# Altium schematic sheet k26_baseboard_usb.SchDoc: k26 Baseboard USB0 PHY and HUB
size A3; DrawnBy: Ch. Vogt; Organization: PBL; DocumentNumber: 1; Revision: r5; SheetNumber: 10
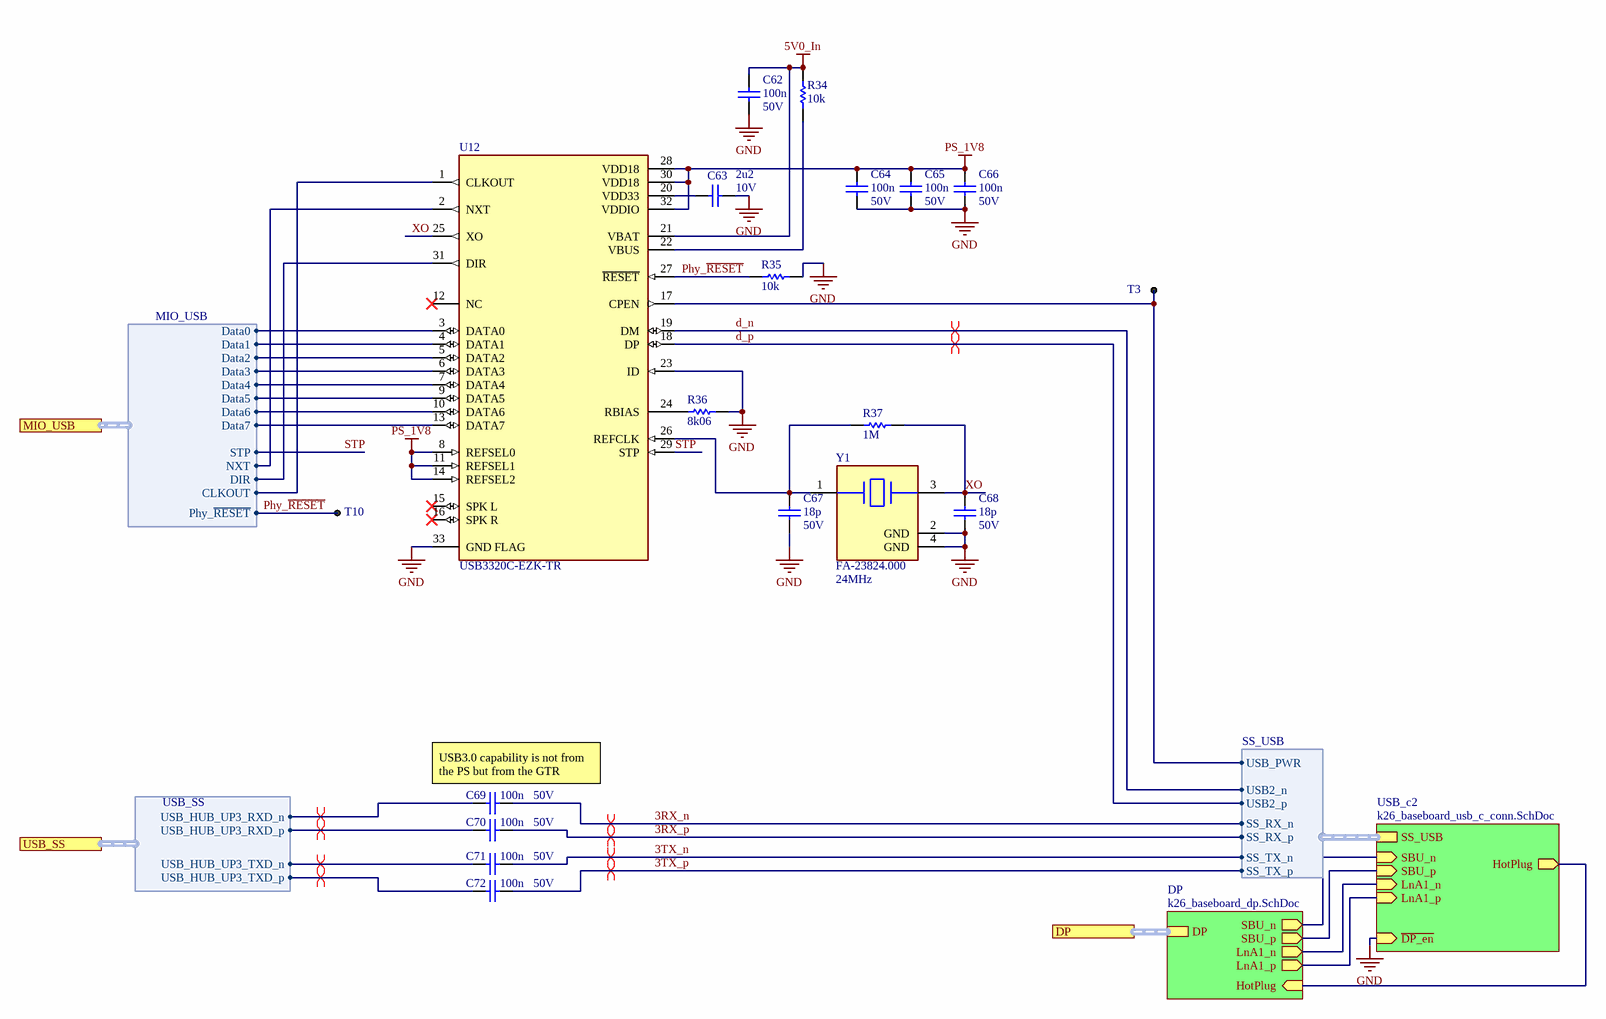
[diagram p0: k26_baseboard_usb.SchDoc]

## Parts
C62  100n  Rated DC Voltage (URdc): 50V  [CAPC0402]
C63  2u2  Rated DC Voltage (URdc): 10V  [CAPC0402]
C64  100n  Rated DC Voltage (URdc): 50V  [CAPC0402]
C65  100n  Rated DC Voltage (URdc): 50V  [CAPC0402]
C66  100n  Rated DC Voltage (URdc): 50V  [CAPC0402]
C67  18p  Rated DC Voltage (URdc): 50V  [CAPC0402]
C68  18p  Rated DC Voltage (URdc): 50V  [CAPC0402]
C69  100n  Rated DC Voltage (URdc): 50V  [CAPC0402]
C70  100n  Rated DC Voltage (URdc): 50V  [CAPC0402]
C71  100n  Rated DC Voltage (URdc): 50V  [CAPC0402]
C72  100n  Rated DC Voltage (URdc): 50V  [CAPC0402]
R34  10k  [RES0402]
R35  10k  [RES0402]
R36  8k06  [RES0402]
R37  1M  [RES0402]
T3  (no value)  [Pad-1mm]  (no BOM)
T10  (no value)  [Pad-1mm]  (no BOM)
U12  USB3320C-EZK-TR  [FP-32QFN-3304-5X5B-IPC_C]
Y1  FA-23824.000  Frequency: 24MHz  [FP-FA-238_27_0000MB-C3-MFG]

## Sub-sheets
DP = k26_baseboard_dp.SchDoc: DP (harness DP), SBU_n (out), SBU_p (out), HotPlug (in), LnA1_p (out), LnA1_n (out)
USB_c2 = k26_baseboard_usb_c_conn.SchDoc: ~{DP_en} (in), SS_USB (harness SS_USB), SBU_n (in), SBU_p (in), HotPlug (out), LnA1_p (in), LnA1_n (in)

## Ports
DP (harness DP), MIO_USB (harness MIO_USB), USB_SS (harness USB_SS)

## Harnesses
MIO_USB: Data0, Data1, Data2, Data3, Data4, Data5, Data6, Data7, STP, NXT, DIR, CLKOUT, Phy_~{RESET}
USB_SS: USB_HUB_UP3_RXD_n, USB_HUB_UP3_RXD_p, USB_HUB_UP3_TXD_n, USB_HUB_UP3_TXD_p
SS_USB: SS_RX_p, SS_RX_n, SS_TX_p, SS_TX_n, USB2_n, USB2_p, USB_PWR

## Nets
5V0_In: C62.2 R34.2 U12.21(VBAT)
GND: C62.1 C63.1 C64.1 C65.1 C66.1 C67.1 C68.1 R35.2 R36.1 U12.23(ID) U12.33(GND_FLAG) Y1.2(GND) Y1.4(GND) ; sheet USB_c2/~{DP_en}
PS_1V8: C64.2 C65.2 C66.2 U12.8(REFSEL0) U12.11(REFSEL1) U12.14(REFSEL2) U12.28(VDD18) U12.30(VDD18) U12.32(VDDIO)
3RX_n: C69.1 ; sheet USB_c2/SS_USB.SS_RX_n
3RX_p: C70.1 ; sheet USB_c2/SS_USB.SS_RX_p
3TX_n: C71.1 ; sheet USB_c2/SS_USB.SS_TX_n
3TX_p: C72.1 ; sheet USB_c2/SS_USB.SS_TX_p
d_n: U12.19(DM) ; sheet USB_c2/SS_USB.USB2_n
d_p: U12.18(DP) ; sheet USB_c2/SS_USB.USB2_p
Phy_~{RESET}: R35.1 T10.1 U12.27(~{RESET}) ; port MIO_USB.Phy_~{RESET}
STP: U12.29(STP) ; port MIO_USB.STP
XO: C68.2 R37.2 U12.25(XO) Y1.3
NetC63_2: C63.2 U12.20(VDD33)
NetC67_2: C67.2 R37.1 U12.26(REFCLK) Y1.1
NetC69_2: C69.2 ; port USB_SS.USB_HUB_UP3_RXD_n
NetC70_2: C70.2 ; port USB_SS.USB_HUB_UP3_RXD_p
NetC71_2: C71.2 ; port USB_SS.USB_HUB_UP3_TXD_n
NetC72_2: C72.2 ; port USB_SS.USB_HUB_UP3_TXD_p
NetR34_1: R34.1 U12.22(VBUS)
NetR36_2: R36.2 U12.24(RBIAS)
NetT3_1: T3.1 U12.17(CPEN) ; sheet USB_c2/SS_USB.USB_PWR
NetU12_1: U12.1(CLKOUT) ; port MIO_USB.CLKOUT
NetU12_2: U12.2(NXT) ; port MIO_USB.NXT
NetU12_3: U12.3(DATA0) ; port MIO_USB.Data0
NetU12_4: U12.4(DATA1) ; port MIO_USB.Data1
NetU12_5: U12.5(DATA2) ; port MIO_USB.Data2
NetU12_6: U12.6(DATA3) ; port MIO_USB.Data3
NetU12_7: U12.7(DATA4) ; port MIO_USB.Data4
NetU12_9: U12.9(DATA5) ; port MIO_USB.Data5
NetU12_10: U12.10(DATA6) ; port MIO_USB.Data6
NetU12_13: U12.13(DATA7) ; port MIO_USB.Data7
NetU12_31: U12.31(DIR) ; port MIO_USB.DIR
(unnamed): sheet USB_c2/SBU_n, sheet DP/SBU_n
(unnamed): sheet USB_c2/SBU_p, sheet DP/SBU_p
(unnamed): sheet USB_c2/HotPlug, sheet DP/HotPlug
(unnamed): sheet USB_c2/LnA1_p, sheet DP/LnA1_p
(unnamed): sheet USB_c2/LnA1_n, sheet DP/LnA1_n

Not connected (* = marked no-connect by the designer): U12 12(NC)* 15(SPK_L)* 16(SPK_R)*

## Buses and harness runs
harness port DP = sheet DP/DP

## Layout directives
differential pair: 3RX_n, 3RX_p, 3TX_n, 3TX_p, d_n, d_p, NetC69_2, NetC70_2, NetC71_2, NetC72_2

## Notes on the sheet
- (near C69) USB3.0 capability is not from the PS but from the GTR
- 1
- 2
- 3
- 4
- 5
- 6
- 7
- 8
- A
- B
- C
- D
- Project:
- Date:
- Drawing number:
- Rev:
- Format:
- A3
- Drawn by:
- Laboratory:
- Page
- Sheet:
- of
- File:

## Library data of the parts
C62 C64-C66 C69-C72 = cap0402: Ceramic Capacitor, Multilayer, Ceramic, 50V, 10% +Tol, 10% -Tol, X5R, 15% TC, 0.1uF, Surface Mount, 0402; Manufacturer: Yageo; Manufacturer Part Number: CC0402KRX5R9BB104; Capacitance: 100nF; Multilayer: Yes; Supplier 1: Farnell; Supplier Part Number 1: 3366442; RoHS: Yes; Category: Ceramic Capacitors; Stock 1: 180000; Pricing 1: 10000=0.00890, 50000=0.00870 (CHF); Mount: Surface Mount; Number of Pins: 2; Dielectric Material: Ceramic; Package Shape: Rectangular; Size Code: 0402; Terminal Finish: Nickel; Min Operating Temperature: -55°C; Max Operating Temperature: 85°C; JESD-609 Code: e3; Capacitor Type: Ceramic; Negative Tolerance: 10%; Temperature Characteristics Code: X5R; Termination: Wraparound; Positive Tolerance: 10%; Package Style: SMTMeter; Packaging: Tape and Reel; Length: 1mm; Width: 0.5mm; Height: 0.5mm; Reach SVHC Compliant: Yes; RoHS Compliant: Yes; ComponentLink1URL: https://datasheet.ciiva.com:443/pdfs/VipMasterIC/IC/YAGO/YAGO-S-A0006851646/YAGO-S-A0006851646-1.pdf?src-supplier=IHS+Markit; ComponentLink1Description: https://datasheet.ciiva.com:443/pdfs/VipMasterIC/IC/YAGO/YAGO-S-A0006851646/YAGO-S-A0006851646-1.pdf?src-supplier=IHS+Markit; ComponentLink2URL: http://www.yageo.com/documents/recent/UPY-GPHC_X5R_4V-to-50V_25.pdf?src-supplier=Digi-Key; ComponentLink2Description: http://www.yageo.com/documents/recent/UPY-GPHC_X5R_4V-to-50V_25.pdf?src-supplier=Digi-Key; ComponentLink3URL: http://www.yageo.com/documents/recent/UPY-GPHC_X5R_4V-to-50V_23.pdf?src-supplier=Digi-Key; ComponentLink3Description: http://www.yageo.com/documents/recent/UPY-GPHC_X5R_4V-to-50V_23.pdf?src-supplier=Digi-Key
C63 = cap0402: Ceramic Capacitor, Multilayer, Ceramic, 10V, 10% +Tol, 10% -Tol, X7S, 22% TC, 2.2uF, Surface Mount, 0402; Manufacturer: TDK; Manufacturer Part Number: C1005X7S1A225K050BC; Multilayer: Yes; Supplier: Rs; Supplier Part Number: 9156436P; RoHS: Yes; Category: Ceramic Capacitors; Stock: 5000; Pricing: 150=0.11900, 500=0.10700, 2500=0.08300 (CHF); Mounting Technology: Surface Mount; Pins: 2; Dielectric Material: Ceramic; Case/Package: 0402; Package Shape: Rectangular; Terminal Finish: Nickel; Min Operating Temperature: -55°C; Max Operating Temperature: 125°C; Value: 2.2uF; Capacitor Type: Ceramic; Tolerance  (fill in as +-): 10%; Packaging: Tape and Reel; Tolerance (fill in as +-): 10%; Temperature Characteristics Code: X7S; JESD-609 Code: e3; Termination: Wraparound; Package Style: SMTMeter; Length: 1mm; Width: 0.5mm; Height: 0.5mm; Reach SVHC Compliant: Yes; RoHS Compliant: Yes; ComponentLink1URL: https://datasheet.ciiva.com:443/pdfs/VipMasterIC/IC/TDKC/TDKC-S-A0008796792/TDKC-S-A0008796792-1.pdf?src-supplier=IHS+Markit; ComponentLink1Description: https://datasheet.ciiva.com:443/pdfs/VipMasterIC/IC/TDKC/TDKC-S-A0008796792/TDKC-S-A0008796792-1.pdf?src-supplier=IHS+Markit; ComponentLink2URL: https://datasheet.ciiva.com/24218/c1005x7s1a225k050bc-264486-24218484.pdf?src-supplier=Mouser; ComponentLink2Description: https://datasheet.ciiva.com/24218/c1005x7s1a225k050bc-264486-24218484.pdf?src-supplier=Mouser; ComponentLink3URL: https://datasheet.ciiva.com/6274/tdkmlcccaprange-6274910.pdf?src-supplier=Digi-Key; ComponentLink3Description: https://datasheet.ciiva.com/6274/tdkmlcccaprange-6274910.pdf?src-supplier=Digi-Key
C67 C68 = cap0402: Ceramic Capacitor, Multilayer, Ceramic, 50V, 5% +Tol, 5% -Tol, C0G, -/+30ppm/Cel TC, 0.000018uF, Surface Mount, 0402; Manufacturer: Murata; Manufacturer Part Number: GRM1555C1H180JA01D; Value: 18pF; Multilayer: Yes; Supplier: Mouser; Supplier Part Number: 81-GRM1555C1H180JA1D; RoHS: Yes; Category: Ceramic Capacitors; Stock: 265782; Pricing: 1=0.10000, 10=0.01500, 50=0.01500, 100=0.00800, 1000=0.00500, 10000=0.00400 (USD); Mounting Technology: Surface Mount; Pins: 2; Dielectric Material: Ceramic; Case/Package: 0402; Terminal Finish: Nickel; Package Shape: Rectangular; Min Operating Temperature: -55°C; Max Operating Temperature: 125°C; JESD-609 Code: e3; Capacitor Type: Ceramic; Tolerance  (fill in as +-): 5%; Packaging: Tape and Reel; Tolerance (fill in as +-): 5%; Temperature Characteristics Code: C0G; Termination: Wraparound; Package Style: SMTMeter; Length: 1mm; Width: 0.5mm; Height: 0.5mm; RoHS Compliant: Yes; Reach SVHC Compliant: Yes
  C67: ComponentLink1URL: https://datasheet.ciiva.com:443/pdfs/VipMasterIC/IC/MURE/MURE-S-A0008911298/MURE-S-A0008911417-1.pdf?src-supplier=IHS+Markit; ComponentLink1Description: https://datasheet.ciiva.com:443/pdfs/VipMasterIC/IC/MURE/MURE-S-A0008911298/MURE-S-A0008911417-1.pdf?src-supplier=IHS+Markit; ComponentLink2URL: https://datasheet.ciiva.com/6068/1747440-6068179.pdf?src-supplier=Farnell; ComponentLink2Description: https://datasheet.ciiva.com/6068/1747440-6068179.pdf?src-supplier=Farnell; ComponentLink3URL: https://datasheet.ciiva.com/18184/getdatasheetpartid-316062-18184207.pdf?src-supplier=Verical; ComponentLink3Description: https://datasheet.ciiva.com/18184/getdatasheetpartid-316062-18184207.pdf?src-supplier=Verical; ComponentLink4URL: https://datasheet.ciiva.com/11786/0900766b80ef921d-11786269.pdf?src-supplier=Rs; ComponentLink4Description: https://datasheet.ciiva.com/11786/0900766b80ef921d-11786269.pdf?src-supplier=Rs; ComponentLink5URL: https://datasheet.ciiva.com/29200/453634-da-01-en-vs-kondensator-0402-29200152.pdf?src-supplier=Conrad; ComponentLink5Description: https://datasheet.ciiva.com/29200/453634-da-01-en-vs-kondensator-0402-29200152.pdf?src-supplier=Conrad; ComponentLink6URL: https://datasheet.ciiva.com/22698/1747440-22698394.pdf?src-supplier=Element14; ComponentLink6Description: https://datasheet.ciiva.com/22698/1747440-22698394.pdf?src-supplier=Element14; ComponentLink7URL: https://datasheet.ciiva.com/163/partnumbering-e-01-163478.pdf?src-supplier=Digi-Key; ComponentLink7Description: https://datasheet.ciiva.com/163/partnumbering-e-01-163478.pdf?src-supplier=Digi-Key; ComponentLink8URL: https://datasheet.ciiva.com/163/partnumbering-e-01-163477.pdf?src-supplier=Digi-Key; ComponentLink8Description: https://datasheet.ciiva.com/163/partnumbering-e-01-163477.pdf?src-supplier=Digi-Key; ComponentLink9URL: https://datasheet.ciiva.com/163/partnumbering-e-01-163479.pdf?src-supplier=Digi-Key; ComponentLink9Description: https://datasheet.ciiva.com/163/partnumbering-e-01-163479.pdf?src-supplier=Digi-Key; ComponentLink10URL: https://datasheet.ciiva.com/5419/product-5419130.pdf?src-supplier=Mouser; ComponentLink10Description: https://datasheet.ciiva.com/5419/product-5419130.pdf?src-supplier=Mouser
  C68: ComponentLink1URL: https://datasheet.ciiva.com:443/pdfs/VipMasterIC/IC/YAGO/YAGO-S-A0006851646/YAGO-S-A0006851646-1.pdf?src-supplier=IHS+Markit; ComponentLink1Description: https://datasheet.ciiva.com:443/pdfs/VipMasterIC/IC/YAGO/YAGO-S-A0006851646/YAGO-S-A0006851646-1.pdf?src-supplier=IHS+Markit; ComponentLink2URL: http://www.yageo.com/documents/recent/UPY-GPHC_X5R_4V-to-50V_25.pdf?src-supplier=Digi-Key; ComponentLink2Description: http://www.yageo.com/documents/recent/UPY-GPHC_X5R_4V-to-50V_25.pdf?src-supplier=Digi-Key; ComponentLink3URL: http://www.yageo.com/documents/recent/UPY-GPHC_X5R_4V-to-50V_23.pdf?src-supplier=Digi-Key; ComponentLink3Description: http://www.yageo.com/documents/recent/UPY-GPHC_X5R_4V-to-50V_23.pdf?src-supplier=Digi-Key; ComponentLink4URL: https://datasheet.ciiva.com:443/pdfs/VipMasterIC/IC/MURE/MURE-S-A0008911298/MURE-S-A0008911417-1.pdf?src-supplier=IHS+Markit; ComponentLink4Description: https://datasheet.ciiva.com:443/pdfs/VipMasterIC/IC/MURE/MURE-S-A0008911298/MURE-S-A0008911417-1.pdf?src-supplier=IHS+Markit; ComponentLink5URL: https://datasheet.ciiva.com/6068/1747440-6068179.pdf?src-supplier=Farnell; ComponentLink5Description: https://datasheet.ciiva.com/6068/1747440-6068179.pdf?src-supplier=Farnell; ComponentLink6URL: https://datasheet.ciiva.com/18184/getdatasheetpartid-316062-18184207.pdf?src-supplier=Verical; ComponentLink6Description: https://datasheet.ciiva.com/18184/getdatasheetpartid-316062-18184207.pdf?src-supplier=Verical; ComponentLink7URL: https://datasheet.ciiva.com/11786/0900766b80ef921d-11786269.pdf?src-supplier=Rs; ComponentLink7Description: https://datasheet.ciiva.com/11786/0900766b80ef921d-11786269.pdf?src-supplier=Rs; ComponentLink8URL: https://datasheet.ciiva.com/29200/453634-da-01-en-vs-kondensator-0402-29200152.pdf?src-supplier=Conrad; ComponentLink8Description: https://datasheet.ciiva.com/29200/453634-da-01-en-vs-kondensator-0402-29200152.pdf?src-supplier=Conrad; ComponentLink9URL: https://datasheet.ciiva.com/22698/1747440-22698394.pdf?src-supplier=Element14; ComponentLink9Description: https://datasheet.ciiva.com/22698/1747440-22698394.pdf?src-supplier=Element14; ComponentLink10URL: https://datasheet.ciiva.com/163/partnumbering-e-01-163478.pdf?src-supplier=Digi-Key; ComponentLink10Description: https://datasheet.ciiva.com/163/partnumbering-e-01-163478.pdf?src-supplier=Digi-Key; ComponentLink11URL: https://datasheet.ciiva.com/163/partnumbering-e-01-163477.pdf?src-supplier=Digi-Key; ComponentLink11Description: https://datasheet.ciiva.com/163/partnumbering-e-01-163477.pdf?src-supplier=Digi-Key; ComponentLink12URL: https://datasheet.ciiva.com/163/partnumbering-e-01-163479.pdf?src-supplier=Digi-Key; ComponentLink12Description: https://datasheet.ciiva.com/163/partnumbering-e-01-163479.pdf?src-supplier=Digi-Key; ComponentLink13URL: https://datasheet.ciiva.com/5419/product-5419130.pdf?src-supplier=Mouser; ComponentLink13Description: https://datasheet.ciiva.com/5419/product-5419130.pdf?src-supplier=Mouser
R34 R35 = res0402: Fixed Resistor, Metal Glaze/thick Film, 0.1W, 10000ohm, 50V, 1% +/-Tol, 100ppm/Cel, Surface Mount, 0402; Manufacturer: Panasonic; Manufacturer Part Number: ERJ-2RKF1002X; Power: 100mW; Value: 10kR; Temperature Coefficient: 100ppm/°C; Rated Temperature: 70°C; Package Height: 0.35mm; Package Length: 1mm; Package Width: 0.5mm; Reference Standard: AEC-Q200; ComponentLink1URL: https://datasheet.ciiva.com:443/pdfs/VipMasterIC/IC/PANA/PANA-S-A0009889626/PANA-S-A0009889626-1.pdf?src-supplier=IHS+Markit; ComponentLink1Description: https://datasheet.ciiva.com:443/pdfs/VipMasterIC/IC/PANA/PANA-S-A0009889626/PANA-S-A0009889626-1.pdf?src-supplier=IHS+Markit; ComponentLink2URL: https://datasheet.ciiva.com/6201/426256-6201373.pdf?src-supplier=Farnell; ComponentLink2Description: https://datasheet.ciiva.com/6201/426256-6201373.pdf?src-supplier=Farnell; ComponentLink3URL: https://datasheet.ciiva.com/46377/426256-46377550.pdf?src-supplier=Element14; ComponentLink3Description: https://datasheet.ciiva.com/46377/426256-46377550.pdf?src-supplier=Element14; ComponentLink4URL: https://datasheet.ciiva.com/22749/1678782-22749610.pdf?src-supplier=Element14; ComponentLink4Description: https://datasheet.ciiva.com/22749/1678782-22749610.pdf?src-supplier=Element14; ComponentLink5URL: https://datasheet.ciiva.com/28695/1678782-28695781.pdf?src-supplier=Element14; ComponentLink5Description: https://datasheet.ciiva.com/28695/1678782-28695781.pdf?src-supplier=Element14; ComponentLink6URL: https://datasheet.ciiva.com/16766/70260748-16766015.pdf?src-supplier=Allied+Electronics; ComponentLink6Description: https://datasheet.ciiva.com/16766/70260748-16766015.pdf?src-supplier=Allied+Electronics; ComponentLink7URL: https://datasheet.ciiva.com/16765/70260748-16765054.pdf?src-supplier=Allied+Electronics; ComponentLink7Description: https://datasheet.ciiva.com/16765/70260748-16765054.pdf?src-supplier=Allied+Electronics; ComponentLink8URL: https://datasheet.ciiva.com/9181/aoa0000ce2-9181461.pdf?src-supplier=Avnet; ComponentLink8Description: https://datasheet.ciiva.com/9181/aoa0000ce2-9181461.pdf?src-supplier=Avnet; ComponentLink9URL: https://datasheet.ciiva.com/16508/aoa0000ce2-16508382.pdf?src-supplier=Future+Electronics; ComponentLink9Description: https://datasheet.ciiva.com/16508/aoa0000ce2-16508382.pdf?src-supplier=Future+Electronics; Supplier: Rs; Supplier Part Number: 7325246; RoHS: Yes; Category: Chip SMD Resistors; Stock: 1630000; Pricing: 10000=0.00600, 30000=0.00500 (CHF); Mounting Technology: Surface Mount; Pins: 2; Case/Package: 0402; Terminal Finish: Nickel; Package Shape: Rectangular; Min Operating Temperature: -55°C; Max Operating Temperature: 155°C; Tolerance: 1%; Resistor Type: FIXED RESISTOR; Technology: METAL GLAZE/THICK FILM; Termination: Wraparound; Working Voltage: 50V; Construction: Rectangular; Package Style: SMTMeter; Packaging: Tape and Reel; JESD-609 Code: e3; Reach SVHC Compliant: Yes; RoHS Compliant: Yes
R36 = res0402: Fixed Resistor, Metal Glaze/thick Film, 0.063W, 8060ohm, 50V, 1% +/-Tol, 100ppm/Cel, Surface Mount, 0402; Manufacturer: Vishay; Manufacturer Part Number: CRCW04028K06FKED; Power: 63mW; Value: 8.06kR; Temperature Coefficient: 100ppm/°C; Rated Temperature: 70°C; Package Height: 0.35mm; Package Length: 1mm; Package Width: 0.5mm; Reference Standard: AEC-Q200; Supplier: Rs; Supplier Part Number: 6789620; RoHS: Yes; Category: Chip SMD Resistors; Stock: 9150; Pricing: 50=0.05000, 500=0.02000, 1000=0.01600, 2000=0.01400, 4000=0.01300 (CHF); Mounting Technology: Surface Mount; Pins: 2; Case/Package: 0402; Package Shape: Rectangular; Terminal Finish: Nickel; Min Operating Temperature: -55°C; Max Operating Temperature: 155°C; Tolerance: 1%; Resistor Type: FIXED RESISTOR; Packaging: Tape and Reel; Technology: METAL GLAZE/THICK FILM; Termination: Wraparound; Working Voltage: 50V; Construction: Chip; Package Style: SMTMeter; JESD-609 Code: e3; RoHS Compliant: Yes; Reach SVHC Compliant: Yes; ComponentLink1URL: https://datasheet.ciiva.com:443/pdfs/VipMasterIC/IC/VISH/VISH-S-A0007266705/VISH-S-A0007266705-1.pdf?src-supplier=IHS+Markit; ComponentLink1Description: https://datasheet.ciiva.com:443/pdfs/VipMasterIC/IC/VISH/VISH-S-A0007266705/VISH-S-A0007266705-1.pdf?src-supplier=IHS+Markit; ComponentLink2URL: https://datasheet.ciiva.com/11818/0900766b80d98824-11818119.pdf?src-supplier=Rs; ComponentLink2Description: https://datasheet.ciiva.com/11818/0900766b80d98824-11818119.pdf?src-supplier=Rs; ComponentLink3URL: https://datasheet.ciiva.com/5542/dcrcwe3-109170-5542949.pdf?src-supplier=Mouser; ComponentLink3Description: https://datasheet.ciiva.com/5542/dcrcwe3-109170-5542949.pdf?src-supplier=Mouser; ComponentLink4URL: https://datasheet.ciiva.com/16767/70201119-16767653.pdf?src-supplier=Allied+Electronics; ComponentLink4Description: https://datasheet.ciiva.com/16767/70201119-16767653.pdf?src-supplier=Allied+Electronics; ComponentLink5URL: https://datasheet.ciiva.com/7690/1533075-7690854.pdf?src-supplier=Element14; ComponentLink5Description: https://datasheet.ciiva.com/7690/1533075-7690854.pdf?src-supplier=Element14; ComponentLink6URL: https://datasheet.ciiva.com/2463/dcrcwe3-2463529.pdf?src-supplier=Digi-Key; ComponentLink6Description: https://datasheet.ciiva.com/2463/dcrcwe3-2463529.pdf?src-supplier=Digi-Key; ComponentLink7URL: https://datasheet.ciiva.com/2463/dcrcwe3-2463530.pdf?src-supplier=Digi-Key; ComponentLink7Description: https://datasheet.ciiva.com/2463/dcrcwe3-2463530.pdf?src-supplier=Digi-Key; ComponentLink8URL: https://datasheet.ciiva.com/2463/dcrcwe3-2463531.pdf?src-supplier=Digi-Key; ComponentLink8Description: https://datasheet.ciiva.com/2463/dcrcwe3-2463531.pdf?src-supplier=Digi-Key; ComponentLink9URL: https://datasheet.ciiva.com/7690/1697337-7690701.pdf?src-supplier=Element14; ComponentLink9Description: https://datasheet.ciiva.com/7690/1697337-7690701.pdf?src-supplier=Element14
R37 = res0402: Fixed Resistor, Metal Glaze/thick Film, 0.1W, 1M0ohm, 50V, 5% +/-Tol, -400,150ppm/Cel, Surface Mount, 0402; Manufacturer: Panasonic; Manufacturer Part Number: ERJ-2GEJ106X; Power: 100mW; Value: 1MR; Rated Temperature: 70°C; Temperature Coefficient: 400ppm/°C; Package Height: 0.35mm; Package Length: 1mm; Package Width: 0.5mm; Reference Standard: AEC-Q200; Supplier: Rs; Supplier Part Number: 7324877; RoHS: Yes; Category: Chip SMD Resistors; Stock: 10053; Pricing: 10000=0.00500 (CHF); Mounting Technology: Surface Mount; Pins: 2; Case/Package: 0402; Package Shape: Rectangular; Terminal Finish: Nickel; Min Operating Temperature: -55°C; Max Operating Temperature: 155°C; Tolerance: 5%; Resistor Type: FIXED RESISTOR; Packaging: Tape and Reel; Working Voltage: 50V; Termination: Wraparound; Construction: Rectangular; Package Style: SMTMeter; Technology: METAL GLAZE/THICK FILM; JESD-609 Code: e3; RoHS Compliant: Yes; Reach SVHC Compliant: Yes
T3 T10 = CMP-01283-1: 1mm SMT Test Pad; Mounting Technology: SMT
U12 = CMP-0186-00336-2: IC TRANSCEIVER HALF 1/1 32QFN; Manufacturer: Microchip; Min Supply Voltage: 1.6V; Usb Standard: USB 2.0; Max Supply Voltage: 5.5V; Nominal Supply Current: 0.7-29400uA; Number Of Ports: 1; Interface: UART,USB; Standoff Height: 0mm; Digikey Description: IC TRANSCEIVER HALF 1/1 32QFN; Category: IC; Mouser Description: Microchip USB3320C-EZK-TR, USB Transceiver, USB 2.0, 1.8 V, 3.3 V, 32-Pin QFN; Ipc Land Pattern Name: QFN50P500X500X85-32; ComponentLink2Description: Datasheet; Device Class L2: Interface ICs; Temperature Range Low: -40°C; Ambient Temperature Range Low: -40°C; ComponentLink2URL: http://ww1.microchip.com/downloads/en/DeviceDoc/00001792E.pdf; Device Class L3: USB Interface ICs; Lead Free: Yes; RoHS: TRUE; Height: 1mm; Temperature Range High: +85°C; Octopart: https://octopart.com/usb3320c-ezk-tr-microchip-24995468; Device Class L1: Integrated Circuits (ICs); Automotive: No; Temperature: -40°C to +85°C; Ambient Temperature Range High: +85°C; Package: 32QFN-3304-5X5B; Manufacturer Part Number: USB3320C-EZK-TR
Y1 = CMP-36405-000008-1: CRYSTAL 24.0000MHZ; Manufacturer: Epson; Manufacturer Part Number: FA-23827.0000MB-C3; Manufacturer Series: FA-238; Esr: 50Ω; Capacitance: 18.0pF; Tolerance: 50ppm; Load Capacitance: 18pF; Value: 18.0pF; Crystal/Resonator Type: PARALLEL - FUNDAMENTAL; Operating Frequency-Nom: 240; Aging: 5 PPM/FIRST YEAR; Drive Level: 1uW; Frequency Stability: 0.003%; Series Resistance: 60R; Additional Feature: TAPE AND REEL; Digikey Description: CRYSTAL 27.0000MHZ 18PF SMD; Package: 0; Height: 0.7mm; Device Class L1: Passive Components; Octopart: https://octopart.com/fa-238+27.0000mb-c3-epson-42855148; Temperature: -20°C to +70°C; Temperature Range Low: -20°C; Temperature Range High: +70°C; Device Class L3: Crystals; Lead Free: Yes; Category: Crys; Series: FA-238; Mouser Description: Crystals 27MHz 50ppm 18pF -20C +70C; Automotive: No; ComponentLink2URL: https://support.epson.biz/td/api/doc_check.php?dl=brief_fa-238v_en.pdf; RoHS: TRUE; Device Class L2: Crystals / Oscillators; ComponentLink2Description: Datasheet; Supplier 1: Digi-Key; Supplier Part Number 1: SER3689CT-ND; Stock 1: 106200; Pricing 1: 1=1.10000, 10=0.97600, 50=0.91200, 100=0.80600 (USD); Mount: Surface Mount; Terminal Finish: Nickel; Min Operating Temperature: -20°C; Max Operating Temperature: 70°C; JESD-609 Code: e4; Frequency Tolerance: 50ppm; Reach SVHC Compliant: Yes; RoHS Compliant: Yes; ComponentLink1URL: https://datasheet.ciiva.com:443/pdfs/VipMasterIC/IC/SEIK/SEIKS03065/SEIKS03065-1.pdf?src-supplier=IHS+Markit; ComponentLink1Description: https://datasheet.ciiva.com:443/pdfs/VipMasterIC/IC/SEIK/SEIKS03065/SEIKS03065-1.pdf?src-supplier=IHS+Markit; ComponentLink3URL: http://www.mouser.com/ds/2/137/A-238_en-932914.pdf?src-supplier=Mouser; ComponentLink3Description: http://www.mouser.com/ds/2/137/A-238_en-932914.pdf?src-supplier=Mouser; ComponentLink4URL: https://www5.epsondevice.com/en/information/support/pdf/june_2018_psc_masterbook.pdf?src-supplier=Digi-Key; ComponentLink4Description: https://www5.epsondevice.com/en/information/support/pdf/june_2018_psc_masterbook.pdf?src-supplier=Digi-Key